# Altium project PCB_RELAIS.PrjPcb
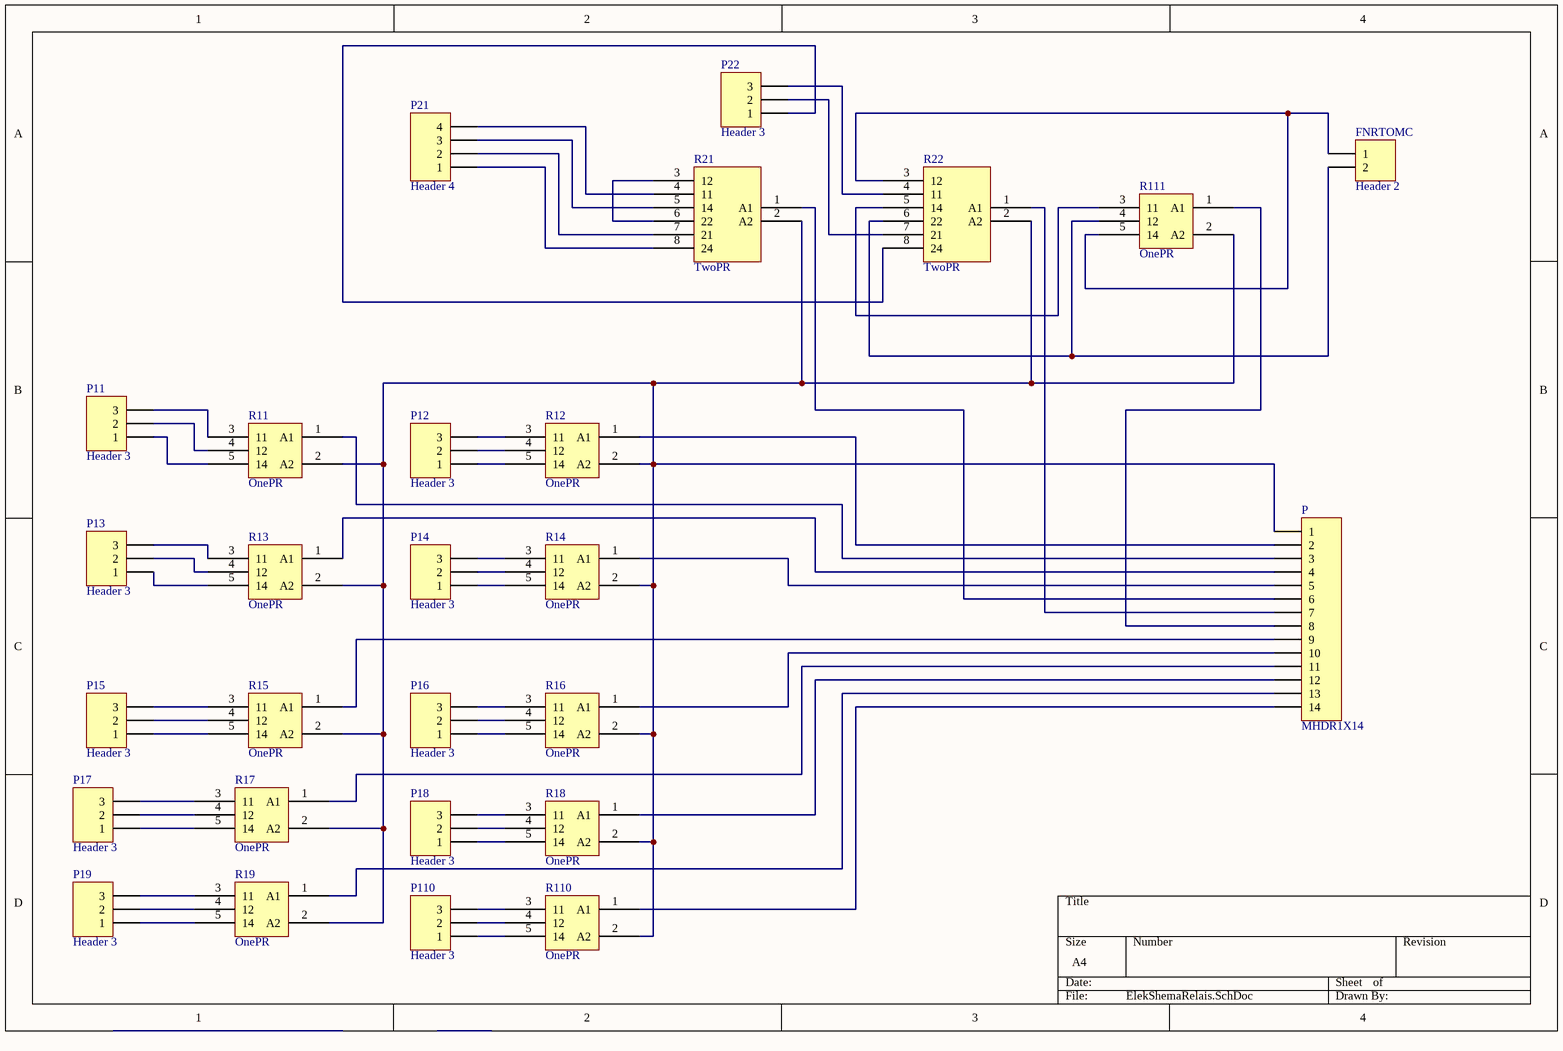
[diagram p0: ElekShemaRelais.SchDoc]
1 sheet, 27 parts. Net scope: global (net labels, ports and power ports of the same name join across sheets).

## Sheet ElekShemaRelais.SchDoc
size A4

### Parts
FNRTOMC  Header 2  [HDR1X2]
P  MHDR1X14  [MHDR1X14]
P11  Header 3  [HDR1X3]
P12  Header 3  [HDR1X3]
P13  Header 3  [HDR1X3]
P14  Header 3  [HDR1X3]
P15  Header 3  [HDR1X3]
P16  Header 3  [HDR1X3]
P17  Header 3  [HDR1X3]
P18  Header 3  [HDR1X3]
P19  Header 3  [HDR1X3]
P21  Header 4  [HDR1X4]
P22  Header 3  [HDR1X3]
P110  Header 3  [HDR1X3]
R11  OnePR
R12  OnePR
R13  OnePR
R14  OnePR
R15  OnePR
R16  OnePR
R17  OnePR
R18  OnePR
R19  OnePR
R21  TwoPR
R22  TwoPR
R110  OnePR
R111  OnePR

### Nets
NetFNRTOMC_1: FNRTOMC.1 R22.3(12) R111.5(14)
NetFNRTOMC_2: FNRTOMC.2 R22.6(22) R111.4(12)
NetP11_1: P11.1 R11.5(14)
NetP11_2: P11.2 R11.4(12)
NetP11_3: P11.3 R11.3(11)
NetP12_1: P12.1 R12.5(14)
NetP12_2: P12.2 R12.4(12)
NetP12_3: P12.3 R12.3(11)
NetP13_1: P13.1 R13.5(14)
NetP13_2: P13.2 R13.4(12)
NetP13_3: P13.3 R13.3(11)
NetP14_1: P14.1 R14.5(14)
NetP14_2: P14.2 R14.4(12)
NetP14_3: P14.3 R14.3(11)
NetP15_1: P15.1 R15.5(14)
NetP15_2: P15.2 R15.4(12)
NetP15_3: P15.3 R15.3(11)
NetP16_1: P16.1 R16.5(14)
NetP16_2: P16.2 R16.4(12)
NetP16_3: P16.3 R16.3(11)
NetP17_1: P17.1 R17.5(14)
NetP17_2: P17.2 R17.4(12)
NetP17_3: P17.3 R17.3(11)
NetP18_1: P18.1 R18.5(14)
NetP18_2: P18.2 R18.4(12)
NetP18_3: P18.3 R18.3(11)
NetP19_1: P19.1 R19.5(14)
NetP19_2: P19.2 R19.4(12)
NetP19_3: P19.3 R19.3(11)
NetP21_1: P21.1 R21.8(24)
NetP21_2: P21.2 R21.7(21)
NetP21_3: P21.3 R21.5(14)
NetP21_4: P21.4 R21.4(11)
NetP22_1: P22.1 R22.8(24)
NetP22_2: P22.2 R22.7(21)
NetP22_3: P22.3 R22.4(11)
NetP110_1: P110.1 R110.5(14)
NetP110_2: P110.2 R110.4(12)
NetP110_3: P110.3 R110.3(11)
NetP_1: P.1 R11.2(A2) R12.2(A2) R13.2(A2) R14.2(A2) R15.2(A2) R16.2(A2) R17.2(A2) R18.2(A2) R19.2(A2) R21.2(A2) R22.2(A2) R110.2(A2) R111.2(A2)
NetP_2: P.2 R12.1(A1)
NetP_3: P.3 R11.1(A1)
NetP_4: P.4 R13.1(A1)
NetP_5: P.5 R14.1(A1)
NetP_6: P.6 R21.1(A1)
NetP_7: P.7 R22.1(A1)
NetP_8: P.8 R111.1(A1)
NetP_9: P.9 R15.1(A1)
NetP_10: P.10 R16.1(A1)
NetP_11: P.11 R17.1(A1)
NetP_12: P.12 R18.1(A1)
NetP_13: P.13 R19.1(A1)
NetP_14: P.14 R110.1(A1)
NetR21_3: R21.3(12) R21.6(22)
NetR22_5: R22.5(14) R111.3(11)

### Library data of the parts
FNRTOMC = Header 2: Header, 2-Pin; LatestRevisionDate: 17-Jul-2002; LatestRevisionNote: Re-released for DXP Platform.; Publisher: Altium Limited
P = MHDR1X14: Header, 14-Pin; LatestRevisionDate: 17-Jul-2002; LatestRevisionNote: Re-released for DXP Platform.; Publisher: Altium Limited
P11-P19 P22 P110 = Header 3: Header, 3-Pin; LatestRevisionDate: 17-Jul-2002; LatestRevisionNote: Re-released for DXP Platform.; Publisher: Altium Limited
P21 = Header 4: Header, 4-Pin; LatestRevisionDate: 17-Jul-2002; LatestRevisionNote: Re-released for DXP Platform.; Publisher: Altium Limited
R11-R19 R110 R111 = R1
R21 R22 = R2